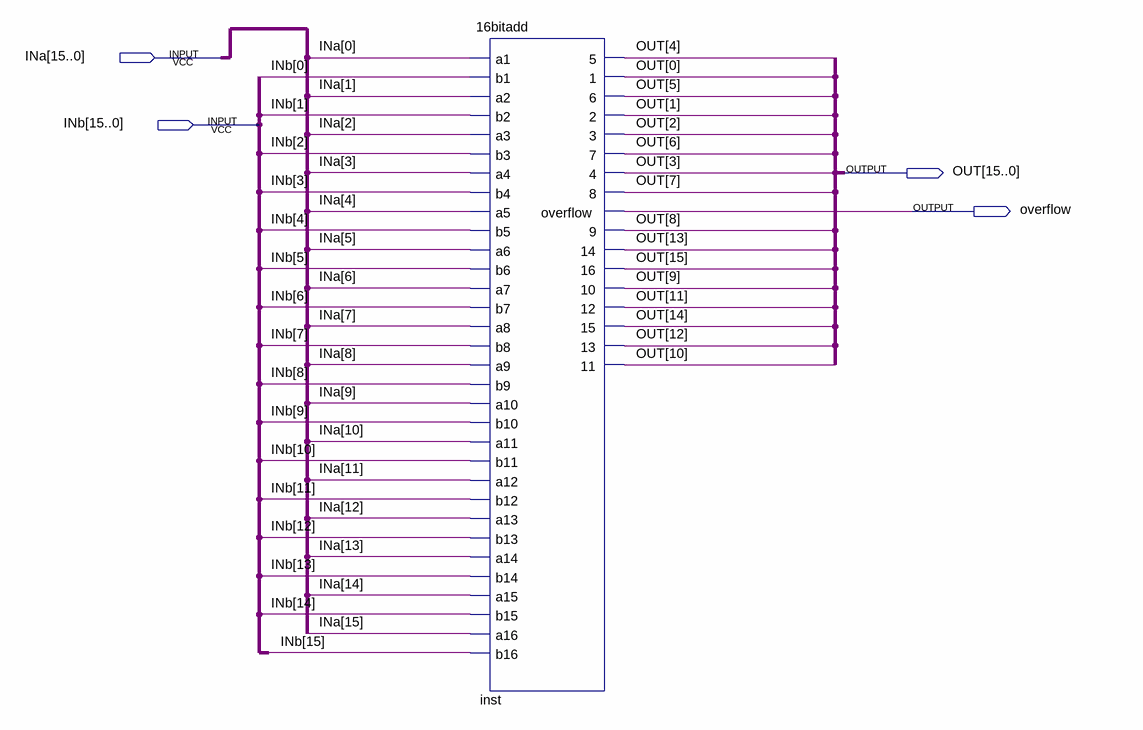
[diagram p0: schematic sheet]
// Quartus schematic 16bitadd2.bdf as structural Verilog: 1 symbols, 4 pins
module \16bitadd2  (
  input  [15:0] INa,
  input  [15:0] INb,
  output [15:0] OUT,
  output overflow
);

  \16bitadd  inst (
    .a1(INa[0]), .b1(INb[0]), .a2(INa[1]), .b2(INb[1]), .a3(INa[2]), .b3(INb[2]), .a4(INa[3]), .b4(INb[3]),
    .a5(INa[4]), .b5(INb[4]), .a6(INa[5]), .b6(INb[5]), .a7(INa[6]), .b7(INb[6]), .a8(INa[7]), .b8(INb[7]),
    .a9(INa[8]), .b9(INb[8]), .a10(INa[9]), .b10(INb[9]), .a11(INa[10]), .b11(INb[10]), .a12(INa[11]),
    .b12(INb[11]), .a13(INa[12]), .b13(INb[12]), .a14(INa[13]), .b14(INb[13]), .a15(INa[14]), .b15(INb[14]),
    .a16(INa[15]), .b16(INb[15]), .\5 (OUT[4]), .\1 (OUT[0]), .\6 (OUT[5]), .\2 (OUT[1]), .\3 (OUT[2]),
    .\7 (OUT[6]), .\4 (OUT[3]), .\8 (OUT[7]), .overflow(overflow), .\9 (OUT[8]), .\14 (OUT[13]),
    .\16 (OUT[15]), .\10 (OUT[9]), .\12 (OUT[11]), .\15 (OUT[14]), .\13 (OUT[12]), .\11 (OUT[10]));
endmodule
